# EAGLE design mini_macro (EAGLE 9.1.0)
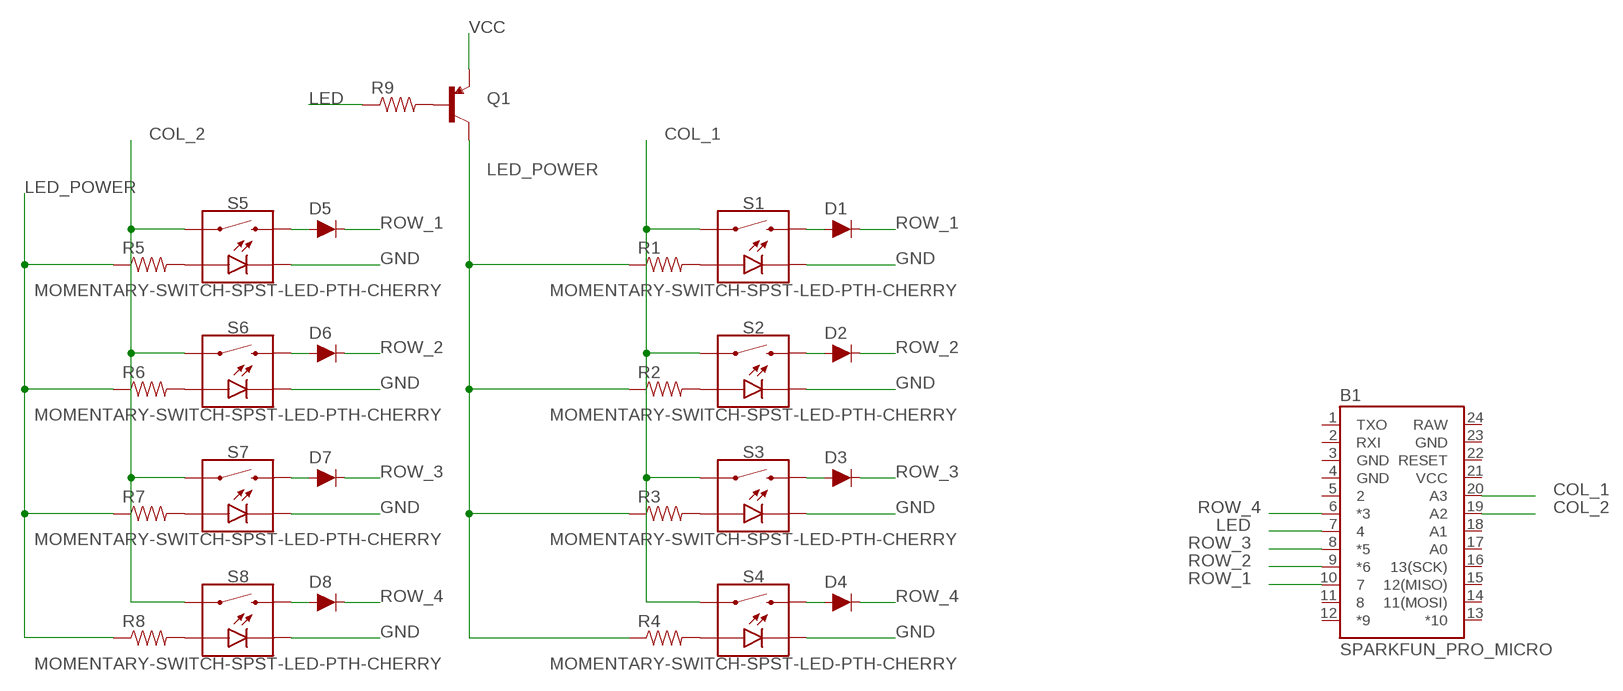
[diagram p0: schematic, sheet 1]

## Parts
B1  SPARKFUN_PRO_MICRO  [SPARKFUN_PRO_MICRO]
D1  DIODE-1N4148  [DIODE-1N4148]
D2  DIODE-1N4148  [DIODE-1N4148]
D3  DIODE-1N4148  [DIODE-1N4148]
D4  DIODE-1N4148  [DIODE-1N4148]
D5  DIODE-1N4148  [DIODE-1N4148]
D6  DIODE-1N4148  [DIODE-1N4148]
D7  DIODE-1N4148  [DIODE-1N4148]
D8  DIODE-1N4148  [DIODE-1N4148]
Q1  TRANSISTOR_PNPSMD  [SOT23-3]
R1  RESISTOR0603-RES  [0603-RES]
R2  RESISTOR0603-RES  [0603-RES]
R3  RESISTOR0603-RES  [0603-RES]
R4  RESISTOR0603-RES  [0603-RES]
R5  RESISTOR0603-RES  [0603-RES]
R6  RESISTOR0603-RES  [0603-RES]
R7  RESISTOR0603-RES  [0603-RES]
R8  RESISTOR0603-RES  [0603-RES]
R9  RESISTOR0603-RES  [0603-RES]
S1  MOMENTARY-SWITCH-SPST-LED-PTH-CHERRY  [CHERRY-MX-LED]
S2  MOMENTARY-SWITCH-SPST-LED-PTH-CHERRY  [CHERRY-MX-LED]
S3  MOMENTARY-SWITCH-SPST-LED-PTH-CHERRY  [CHERRY-MX-LED]
S4  MOMENTARY-SWITCH-SPST-LED-PTH-CHERRY  [CHERRY-MX-LED]
S5  MOMENTARY-SWITCH-SPST-LED-PTH-CHERRY  [CHERRY-MX-LED]
S6  MOMENTARY-SWITCH-SPST-LED-PTH-CHERRY  [CHERRY-MX-LED]
S7  MOMENTARY-SWITCH-SPST-LED-PTH-CHERRY  [CHERRY-MX-LED]
S8  MOMENTARY-SWITCH-SPST-LED-PTH-CHERRY  [CHERRY-MX-LED]

## Nets
COL_1: B1.20(A3) S1.S1 S2.S1 S3.S1 S4.S1
COL_2: B1.19(A2) S5.S1 S6.S1 S7.S1 S8.S1
GND: S1.K(C) S2.K(C) S3.K(C) S4.K(C) S5.K(C) S6.K(C) S7.K(C) S8.K(C)
LED: B1.7 R9.1
LED_POWER: Q1.3(C) R1.1 R2.1 R3.1 R4.1 R5.1 R6.1 R7.1 R8.1
N$1: D1.A S1.S2
N$2: D2.A S2.S2
N$3: D3.A S3.S2
N$4: D4.A S4.S2
N$5: D5.A S5.S2
N$6: D6.A S6.S2
N$7: D7.A S7.S2
N$8: D8.A S8.S2
N$9: R1.2 S1.A
N$10: R2.2 S2.A
N$11: R3.2 S3.A
N$12: R4.2 S4.A
N$13: R5.2 S5.A
N$14: R6.2 S6.A
N$15: R7.2 S7.A
N$16: R8.2 S8.A
N$17: Q1.1(B) R9.2
ROW_1: B1.10 D1.C D5.C
ROW_2: B1.9(*6) D2.C D6.C
ROW_3: B1.8(*5) D3.C D7.C
ROW_4: B1.6(*3) D4.C D8.C
VCC: Q1.2(E)
Unconnected: B1.1(TXO) B1.2(RXI) B1.5 B1.11 B1.12(*9) B1.13(*10) B1.14(11(MOSI)) B1.15(12(MISO)) B1.16(13(SCK)) B1.17(A0) B1.18(A1) B1.22(RESET)

## Power pins joined to a net without a drawn wire
GND: B1.3(GND) B1.4(GND) B1.23(GND)
RAW: B1.24(RAW)
VCC: B1.21(VCC)

## Library data of the parts
B1 = SparkFun-Boards:SPARKFUN_PRO_MICRO: SparkFun Pro Micro Atmega32U4 compatible footprint. SparkFun Products: 3.3V/8MHz <https://www.sparkfun.com/products/12587> 5V/16MHz <https://www.sparkfun.com/products/12640>
D1-D8 = SparkFun-DiscreteSemi:DIODE: Diode These are standard reverse protection diodes and small signal diodes. SparkFun Products: SparkFun SparkPunk Sound Kit <https://www.sparkfun.com/products/11177> SparkFun ESP8266 Thing <https://www.sparkfun.com/products/13231>; PROD_ID: DIO-08378; VALUE: 200mA/100V/1V
Q1 = SparkFun-DiscreteSemi:TRANSISTOR_PNP: Generic PNP BJT Double check pinouts against datasheets- not all devices are the same! MMBT3906 - 40V 200mA SOT-23 (TRANS-08052) MMBT4403 - 40V 600mA SOT-23 (TRANS-09245)
R1-R9 = SparkFun-Passives:RESISTOR: Resistor Basic schematic elements and footprints for 0603, 1206, and PTH resistors.
S1-S8 = Wade-SparkFun-Switches:MOMENTARY-SWITCH-SPST-LED: Momentary Switch (Pushbutton) - SPST - w/ LED Normally-open (NO) SPST momentary switches (buttons, pushbuttons), with a built-in LED. Variants PTH-CHERRY - Cherry MX Switch Cherry MX Keyswitches are top-of-the-line mechanical keyboard switches. They’re satisfyingly “clicky”, reliable up to tens-of-millions of key presses, and a standard in gaming and programming keyboards across the globe. This ‘blue’ version Cherry MX Switch is favored by most due to its secondary internal actuator making it less likely to “double-tap.” If you are looking for a noticeably audible and high-quality key switch, this is the perfect option for you! Cherry MX Switch <https://www.sparkfun.com/products/13834> (COM-13834) Cherry MX Switch Breakout <https://www.sparkfun.com/products/13773> (BOB-13773) PTH-12MM and PTH-12MM-KIT - 12mm Illuminated LED KIT variant is for soldering kits. There is no tStop (covering up the top side of the pads with mask). This helps the beginner see which side they should be soldering too. LED Tactile Button Breakout <https://www.sparkfun.com/products/10467> (BOB-10467) LED Tactile Button - Red <https://www.sparkfun.com/products/10442> (COM-10442) LED Tactile Button - Blue <https://www.sparkfun.com/products/10443> (COM-10443) LED Tactile Button - Green <https://www.sparkfun.com/products/10440> (COM-10440) LED Tactile Button - Orange <https://www.sparkfun.com/products/10441> (COM-10441) LED Tactile Button - White <https://www.sparkfun.com/products/10439> (COM-10439); SF_ID: COM-13834

## Net classes
0 signal: width 0.254 mm

## Board
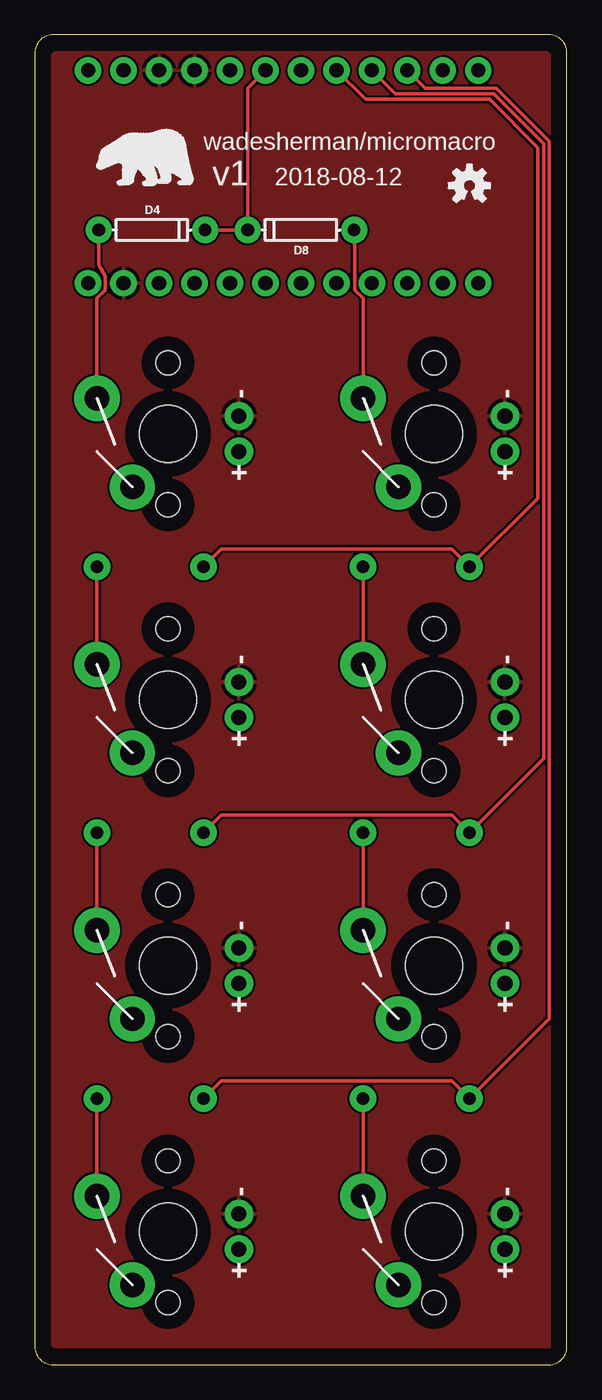
[diagram p1: board, top side]
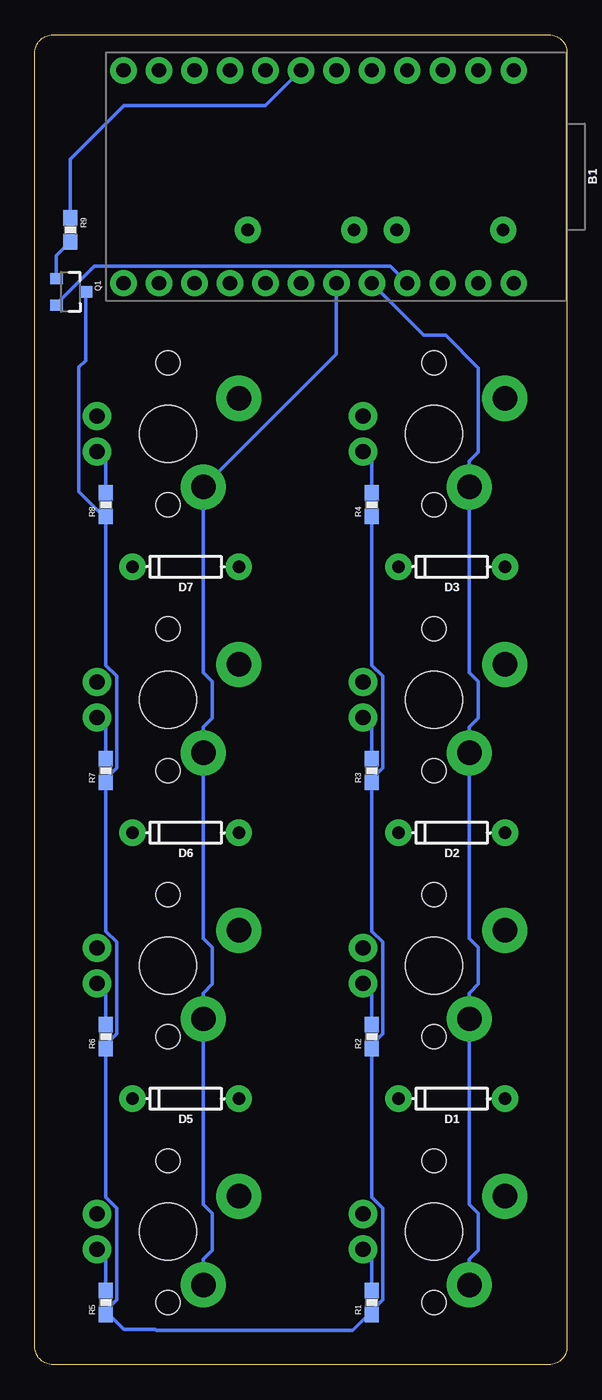
[diagram p2: board, bottom side, seen from below]

Size 38.1 x 95.25 mm. Coordinates in mm from the lower left corner, seen from the top.
Outline: 0,93.98 0,1.27 arc90 1.27,0 36.83,0 arc90 38.1,1.27 38.1,93.98 arc90 36.83,95.25 1.27,95.25 arc90 0,93.98
Copper layers (1*16): Top 0.035mm / dielectric 1.5mm / Bottom 0.035mm
Design rules "default": minimum track width 6mil, minimum drill 0.35mm, track to track 6mil, track to pad 6mil, pad to pad 6mil, via to via 6mil, smd to smd 6mil, copper to edge 40mil, drill to drill 6mil, minimum pad ring 10mil, minimum via ring 8mil, stop-mask expansion 4mil, vias tented up to drill 0mil, thermal gap 10mil

### Footprints (pad centres in the part's own frame; a part is rotated, then mirrored left to right if it is on the bottom)
SPARKFUN_PRO_MICRO = drill 1.016 pad 1.88: 1 -7.62,12.7; 2 -7.62,10.16; 3 -7.62,7.62; 4 -7.62,5.08; 5 -7.62,2.54; 6 -7.62,0; 7 -7.62,-2.54; 8 -7.62,-5.08; 9 -7.62,-7.62; 10 -7.62,-10.16; 11 -7.62,-12.7; 12 -7.62,-15.24; 13 7.62,-15.24; 14 7.62,-12.7; 15 7.62,-10.16; 16 7.62,-7.62; 17 7.62,-5.08; 18 7.62,-2.54; 19 7.62,0; 20 7.62,2.54; 21 7.62,5.08; 22 7.62,7.62; 23 7.62,10.16; 24 7.62,12.7
DIODE-1N4148 = drill 0.9 pad 1.88: A -3.81,0; C 3.81,0
SOT23-3 = smd 0.8 x 0.9: 1 -0.95,-1; 2 0.95,-1; 3 0,1.1
0603-RES = smd 1.1 x 1: 1 -0.85,0; 2 0.85,0
CHERRY-MX-LED = drill 1.092 pad 2.032: A -1.27,-5.08; K 1.27,-5.08 | drill 1.753 pad 3.226: S1 -3.81,2.54; S2 2.54,5.08 | hole 4.089: 0,0 | hole 1.707: -5.08,0; 5.08,0

### Placement (x,y rotation side)
B1  16.51,85.09 270 bottom
D1  8.26,19.05 180 bottom
D2  8.26,38.1 180 bottom
D3  8.26,57.15 180 bottom
D4  8.38,81.28 0 top
D5  27.3,19.05 180 bottom
D6  27.3,38.1 180 bottom
D7  27.3,57.15 180 bottom
D8  19.05,81.28 180 top
Q1  35.56,76.83 270 bottom
R1  13.97,4.45 90 bottom
R2  13.97,23.5 90 bottom
R3  13.97,42.55 90 bottom
R4  13.97,61.59 90 bottom
R5  33.02,4.45 90 bottom
R6  33.02,23.5 90 bottom
R7  33.02,42.55 90 bottom
R8  33.02,61.59 90 bottom
R9  35.56,81.28 270 bottom
S1  9.53,9.53 90 top
S2  9.53,28.57 90 top
S3  9.53,47.62 90 top
S4  9.53,66.67 90 top
S5  28.57,9.53 90 top
S6  28.57,28.57 90 top
S7  28.57,47.62 90 top
S8  28.57,66.67 90 top
U$1  [OSHW-LOGO-S]  31.11,84.45 0 top
U$2  [BEAR]  4.45,84.45 0 top

### Tracks (layer width: path | path; a pad name or v marks a point on that pad's centre or on a via)
COL_1
  Bottom 0.254: S1.S1 6.99,7.56 6.34,8.21 6.34,10.85 6.99,11.49 S2.S1 6.99,26.61 6.34,27.25 6.34,29.89 6.99,30.54 S3.S1 6.99,45.66 6.34,46.3 6.34,48.95 6.99,49.59 S4.S1 6.99,64.71 6.34,65.36 6.34,71.39 8.7,73.75 10.25,73.75 B1.20
COL_2
  Bottom 0.254: S5.S1 26.04,7.56 25.39,8.21 25.39,10.85 26.04,11.49 S6.S1 26.04,26.61 25.39,27.25 25.39,29.89 26.04,30.54 S7.S1 26.04,45.66 25.39,46.3 25.39,48.95 26.04,49.59 S8.S1 16.51,72.39 B1.19
GND
  pour Top: 36.83,1.27 1.52,1.27 arc-90 1.27,1.52 1.27,93.73 arc-90 1.52,93.98 36.58,93.98 arc-90 36.83,93.73
LED
  Bottom 0.254: B1.7 21.59,90.17 31.75,90.17 35.56,86.36 R9.1
LED_POWER
  Bottom 0.254: Q1.3 34.46,71.92 34.95,71.44 34.95,62.53 33.16,60.74 R8.1 33.02,50.09 32.24,49.31 32.24,42.73 33.02,41.95 R7.1 33.02,31.04 32.24,30.26 32.24,23.68 33.02,22.9 R6.1 33.02,11.99 32.24,11.21 32.24,4.63 33.02,3.85 R5.1 32.91,3.6 arc45 32.73,3.52 31.75,2.54 29.49,2.54 29.4,2.45 15.33,2.45 14.26,3.52 arc45 14.08,3.6 R1.1 13.97,3.85 13.19,4.63 13.19,11.21 13.97,11.99 R2.1 13.97,22.9 13.19,23.68 13.19,30.26 13.97,31.04 R3.1 13.97,41.95 13.19,42.73 13.19,49.31 13.97,50.09 R4.1
N$1
  Top 0.254: S1.S2 D1.A
N$2
  Top 0.254: D2.A S2.S2
N$3
  Top 0.254: D3.A S3.S2
N$4
  Top 0.254: S4.S2 4.45,76.38 5.03,76.97 5.03,77.97 4.57,78.79 D4.A
N$5
  Top 0.254: D5.A S5.S2
N$6
  Top 0.254: D6.A S6.S2
N$7
  Top 0.254: D7.A S7.S2
N$8
  Top 0.254: S8.S2 23.5,76.38 22.91,76.97 22.91,81.23 D8.A
N$9
  Bottom 0.254: R1.2 13.97,7.51 arc-45 14.04,7.69 S1.A
N$10
  Bottom 0.254: R2.2 13.97,26.57 arc-45 14.04,26.74 S2.A
N$11
  Bottom 0.254: R3.2 13.97,45.62 arc-45 14.04,45.79 S3.A
N$12
  Bottom 0.254: R4.2 13.97,64.67 arc-45 14.04,64.84 S4.A
N$13
  Bottom 0.254: R5.2 33.02,7.62 S5.A
N$14
  Bottom 0.254: R6.2 33.02,26.57 arc-45 33.09,26.74 S6.A
N$15
  Bottom 0.254: R7.2 33.02,45.62 arc-45 33.09,45.79 S7.A
N$16
  Bottom 0.254: R8.2 33.02,64.67 arc-45 33.09,64.84 S8.A
N$17
  Bottom 0.254: R9.2 36.56,79.43 Q1.1
ROW_1
  Top 0.254: 36.83,80.01 36.83,24.77 D5.C 29.84,20.32 13.34,20.32 D1.C | 36.83,80.01 | B1.10 27.94,91.44 33.02,91.44 36.83,87.63 36.83,80.01
ROW_2
  Top 0.254: B1.9 25.81,91.03 32.85,91.03 36.42,87.46 36.42,43.41 D6.C 29.84,39.37 13.34,39.37 D2.C
ROW_3
  Top 0.254: B1.8 23.67,90.63 32.56,90.63 36.02,87.17 36.02,62.05 D7.C 29.84,58.42 13.34,58.42 D3.C
ROW_4
  Top 0.254: D4.C D8.C 15.24,91.44 B1.6
VCC
  Bottom 0.254: B1.21 12.65,78.69 33.85,78.69 36.56,75.98 Q1.2

### Text on the board
tPlace: wadesherman/micromacro | v1 | 2018-08-12
_tNames: D4 | D8
_bNames: B1 | R9 | Q1 | R4 | R8 | D3 | D7 | R3 | R7 | D2 | D6 | R2 | R6 | D1 | D5 | R1 | R5